# EAGLE design PCB_4_ANILLOS (EAGLE 9.6.2)
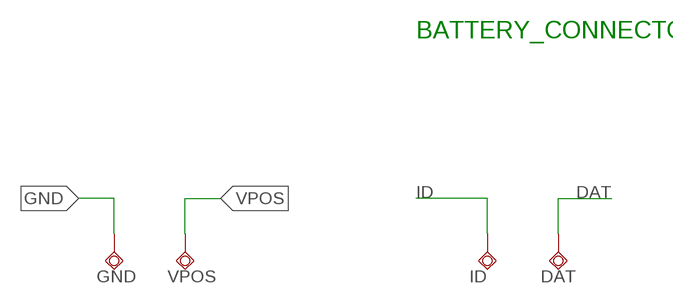
[diagram p0: schematic, sheet 1]

## Parts
DAT  TESTPAD_TPSQB1,27  [TESTPAD_B1,27]
GND  TESTPAD_TPSQB1,27  [TESTPAD_B1,27]
ID  TESTPAD_TPSQB1,27  [TESTPAD_B1,27]
VPOS  TESTPAD_TPSQB1,27  [TESTPAD_B1,27]

## Nets
DAT: DAT.TP
GND: GND.TP
ID: ID.TP
VPOS: VPOS.TP

## Notes on the sheet
- BATTERY_CONNECTOR

## Library data of the parts
DAT GND ID VPOS = BeagleBone_Blue_R3:TESTPAD_TPSQ: Test pad

## Board
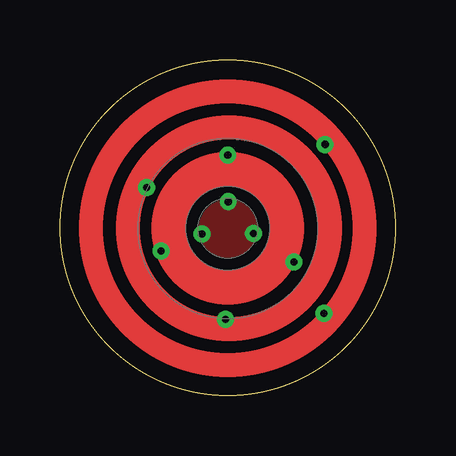
[diagram p1: board, top side]
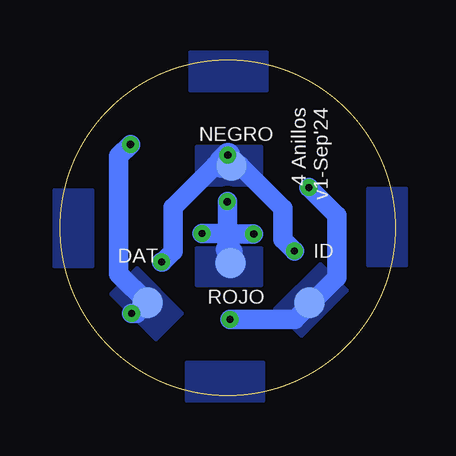
[diagram p2: board, bottom side, seen from below]

Size 14 x 14 mm. Coordinates in mm from the lower left corner, seen from the top.
Outline: circle at 7,7 radius 7
Copper layers (1+2*15+16): Top 0.035mm / dielectric 1.5mm / Route2 0.035mm / dielectric 0.15mm / Route15 0.035mm / dielectric 0.2mm / Bottom 0.035mm
Design rules "default *": minimum track width 0.00038125mm, minimum drill 0.3mm, track to track 10mil, track to pad 10mil, pad to pad 10mil, via to via 10mil, smd to smd 0mil, copper to edge 0mil, drill to drill 6mil, minimum pad ring 10mil, minimum via ring 8mil, stop-mask expansion 0mil, vias tented up to drill 50mil, thermal gap 0mil

### Footprints (pad centres in the part's own frame; a part is rotated, then mirrored left to right if it is on the bottom)
TESTPAD_B1,27 = smd 1.27 x 1.27: TP 0,0

### Placement (x,y rotation side)
DAT  10.35,3.87 0 bottom
GND  6.84,9.59 0 bottom
ID  3.6,3.87 0 bottom
VPOS  6.89,5.53 0 bottom

### Tracks (layer width: path | path; a pad name or v marks a point on that pad's centre or on a via)
DAT  (via drill 0.3)
  Bottom 0.813: v11.01,3.42 10.8,3.42 DAT.TP 11.55,5.07 11.55,9.98 v11.06,10.47
  pour Bottom: 11.89,4.23 9.98,2.32 8.88,3.43 10.79,5.34
GND  (via drill 0.3)
  Bottom 0.813: v4.22,6.02 4.7,6.5 4.7,7.8 6.49,9.59 GND.TP 7.27,9.59 7.53,9.59 9.28,7.84 9.28,6 9.71,5.57 v9.76,5.57
  Bottom 1.016: 7.27,9.59 7.27,9.76 v7,10.04
  pour Bottom: 5.6,10.38 8.3,10.38 8.3,8.78 5.6,8.78
ID  (via drill 0.3)
  Bottom 0.813: v3.61,8.67 2.45,7.51 2.45,4.92 3.5,3.87 ID.TP 3.6,3.77 4.2,3.17 v6.91,3.17
  pour Bottom: 3.14,5.51 5.05,3.6 3.92,2.48 2.01,4.39
N$1
  pour Bottom: 5.52,-0.23 5.52,1.37 8.72,1.37 8.72,-0.23
N$2
  pour Bottom: 12.64,8.57 14.24,8.57 14.24,5.38 12.64,5.38
N$3
  pour Bottom: -0.45,8.62 1.15,8.62 1.15,5.42 -0.45,5.42
N$4
  pour Bottom: 5.37,12.72 5.37,14.32 8.57,14.32 8.57,12.72
VPOS  (via drill 0.3)
  Bottom 0.813: 6.99,6.96 6.76,6.73 v5.92,6.73 | 6.99,6.75 v8.07,6.75 | 6.99,6.08 6.99,6.75 | 6.99,6.75 6.99,6.96 | v7.02,8.08 7.02,6.99 6.99,6.96
  Bottom 1.016: VPOS.TP 6.89,5.98 6.99,6.08
  pour Bottom: 5.6,6.15 8.3,6.15 8.3,4.59 5.6,4.59
  pour Top (isolate 0.5): 8.26,6.96 arc180 5.76,6.96 arc180
(copper drawn outside any net)
  shapes: Top circle x3

### Text on the board
bPlace: 4 Anillos / v1-Sep'24 | NEGRO | ROJO